# Altium schematic sheet boltanka.SchDoc
size A
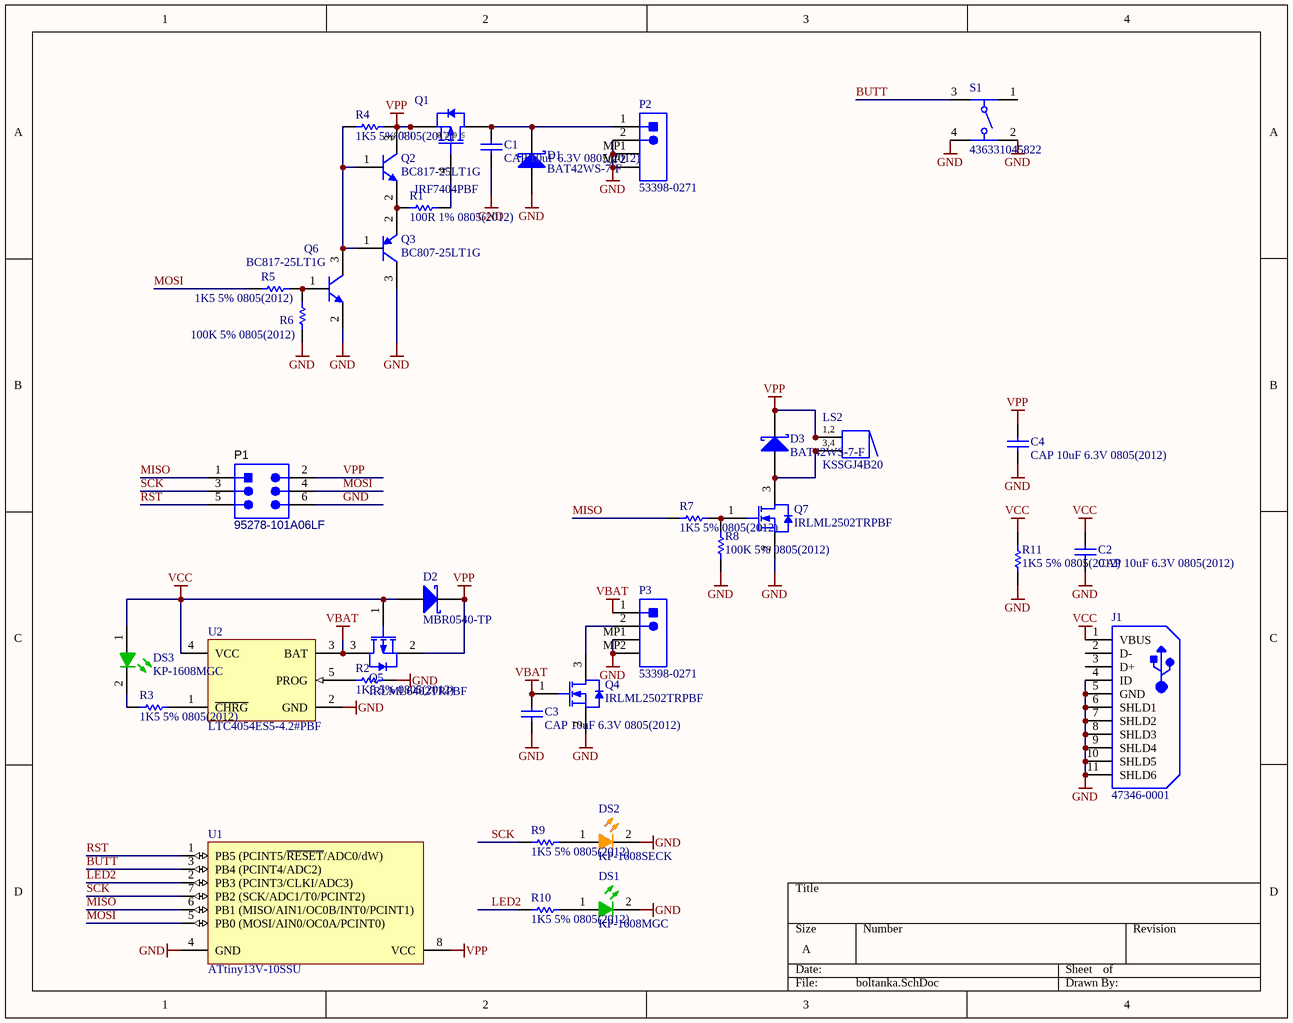
[diagram p0: boltanka.SchDoc]

## Parts
C1  CAP 10uF 6.3V 0805(2012)  [CAPC0805(2012)100_L]
C2  CAP 10uF 6.3V 0805(2012)  [CAPC0805(2012)100_L]
C3  CAP 10uF 6.3V 0805(2012)  [CAPC0805(2012)100_L]
C4  CAP 10uF 6.3V 0805(2012)  [CAPC0805(2012)100_L]
D1  BAT42WS-7-F  [DIOD-SOD323-2_V]
D2  MBR0540-TP  [MCC-SOD123_V]
D3  BAT42WS-7-F  [DIOD-SOD323-2_V]
DS1  KP-1608MGC  [KING-0603LED_GREEN_V]
DS2  KP-1608SECK  [KING-0603LED_ORANGE_V]
DS3  KP-1608MGC  [KING-0603LED_GREEN_V]
J1  47346-0001  [MOLX-47346-0001-5_V]
LS2  KSSGJ4B20  [KINGS-KSSGJ4B20_V]
P1  95278-101A06LF  [AMPM-95278-101A06LF_V]
P2  53398-0271  [MOLX-53398-0271_V]
P3  53398-0271  [MOLX-53398-0271_V]
Q1  IRF7404PBF  [INF-SOIC-8_V]
Q2  BC817-25LT1G  [ONSC-SOT-23-3-318-08_V]
Q3  BC807-25LT1G  [ONSC-SOT-23-3-318-08_V]
Q4  IRLML2502TRPBF  [INTR-SOT-23-3_V]
Q5  IRLML6402TRPBF  [INTR-SOT-23-3_V]
Q6  BC817-25LT1G  [ONSC-SOT-23-3-318-08_V]
Q7  IRLML2502TRPBF  [INTR-SOT-23-3_V]
R1  100R 1% 0805(2012)  [RESC0805(2012)_L]
R2  1K5 5% 0805(2012)  [RESC0805(2012)_L]
R3  1K5 5% 0805(2012)  [RESC0805(2012)_L]
R4  1K5 5% 0805(2012)  [RESC0805(2012)_L]
R5  1K5 5% 0805(2012)  [RESC0805(2012)_L]
R6  100K 5% 0805(2012)  [RESC0805(2012)_L]
R7  1K5 5% 0805(2012)  [RESC0805(2012)_L]
R8  100K 5% 0805(2012)  [RESC0805(2012)_L]
R9  1K5 5% 0805(2012)  [RESC0805(2012)_L]
R10  1K5 5% 0805(2012)  [RESC0805(2012)_L]
R11  1K5 5% 0805(2012)  [RESC0805(2012)_L]
S1  436331045822  [4363x10458xx]
U1  ATtiny13V-10SSU  [S8S1_M]
U2  LTC4054ES5-4.2#PBF  [LT-S5-5-TSOT-23_M]

## Nets
GND: C1.1 C2.1 C3.1 C4.1 D1.1(A) DS1.2(K) DS2.2(K) J1.4(ID) J1.5(GND) J1.6(SHLD1) J1.7(SHLD2) J1.8(SHLD3) J1.9(SHLD4) J1.10(SHLD5) J1.11(SHLD6) P1.6 P2.2 P2.MP1 P2.MP2 P3.MP1 P3.MP2 Q3.3(C) Q4.2(S) Q6.2(E) Q7.2(S) R2.2 R6.1 R8.1 R11.1 S1.2 S1.4 U1.4(GND) U2.2(GND)
VBAT: C3.2 P3.1 Q4.1(G) Q5.3(DRAIN) U2.3(BAT)
VCC: C2.2 D2.1(A) DS3.1(A) J1.1(VBUS) Q5.1(GATE) R11.2 U2.4(VCC)
VPP: C4.2 D2.2(K) D3.2(K) LS2.1 LS2.2 P1.2 Q1.1(S) Q1.2(S) Q1.3(S) Q2.3(C) Q5.2(SOURCE) R4.2 U1.8(VCC)
BUTT: S1.3 U1.3(PB4_(PCINT4/ADC2))
LED2: R10.1 U1.2(PB3_(PCINT3/CLKI/ADC3))
MISO: P1.1 R7.1 U1.6(PB1_(MISO/AIN1/OC0B/INT0/PCINT1))
MOSI: P1.4 R5.1 U1.5(PB0_(MOSI/AIN0/OC0A/PCINT0))
RST: P1.5 U1.1(PB5_(PCINT5/~{RESET}/ADC0/dW))
SCK: P1.3 R9.1 U1.7(PB2_(SCK/ADC1/T0/PCINT2))
NetC1_2: C1.2 D1.2(K) P2.1 Q1.5(D) Q1.6(D) Q1.7(D) Q1.8(D)
NetD3_1: D3.1(A) LS2.3 LS2.4 Q7.3(D)
NetDS1_1: DS1.1(A) R10.2
NetDS2_1: DS2.1(A) R9.2
NetDS3_2: DS3.2(K) R3.1
NetP3_2: P3.2 Q4.3(D)
NetQ1_4: Q1.4(G) R1.2
NetQ2_1: Q2.1(B) Q3.1(B) Q6.3(C) R4.1
NetQ2_2: Q2.2(E) Q3.2(E) R1.1
NetQ6_1: Q6.1(B) R5.2 R6.2
NetQ7_1: Q7.1(G) R7.2 R8.2
NetR2_1: R2.1 U2.5(PROG)
NetR3_2: R3.2 U2.1(~{CHRG})

Not connected (* = marked no-connect by the designer): J1 2(D-) 3(D+); S1 1

## Notes on the sheet
- (in symbol CMP-2000-06465-1) 1, 2, 3; 5, 6, 7, 8
- (in symbol CMP-2000-06519-1) 1,2; 3,4

## Library data of the parts
C1-C4 = CMP-1036-04917-1: CAP 10uF 6.3V ±10% 0805 (2012 Metric) Thickness 1mm SMD; Tolerance: Â±10%; Case-EIA: 0805; Case-Metric: 2012; Max Thickness: 1 mm; Value: 10uF; Technology: SMT; Rated Voltage: 6.3 V
D1 D3 = CMP-2000-05925-1: Schottky Barrier Diode, 30 V, -55 to 125 degC, 2-Pin SOD323, RoHS, Tape and Reel; Manufacturer: DiodesIncorporated; Ir - Reverse Current: 0.5uAat25V; Type: SurfaceMountSchottkyBarrierDiode; If - Forward Current: 0.1A; Pd - Power Dissipation: 200mW; Vf - Forward Voltage: 1Vat0.2A; Unit Weight: 0.000173oz; Ifsm - Forward Surge Current: 4A; trr - Reverse Recovery time: 5ns; Configuration: Single; Vrrm - Repetitive Reverse Voltage: 30V; RoHS: True; Height: 1mm; Length: 1.8mm; Packaging: Reel; Package Reference: SOD323-2; Manufacturer URL: http://www.diodes.com/; Mounting Style: SMD/SMT; Datasheet URL: http://www.diodes.com/_files/datasheets/ds30100.pdf; Package URL: http://www.vishay.com/docs/71192/71192.pdf; Maximum Operating Temperature: +125C; Brand: DiodesIncorporated; Series: BAT42; Technology: Si; Package / Case: SOD-323; Width: 1.4mm; Package Description: 2-Pin Surface Mount Device, Body 1.7 x 1.3 mm; Termination Style: SMD/SMT; Minimum Operating Temperature: -55C; Datasheet Version: Rev. 14-2, 06/2012; Operating Temperature Range: -55Cto+125C; Product: SchottkyDiodes; Mounting Technology: SurfaceMount; Product Category: SchottkyDiodes&Rectifiers; Factory Pack Quantity: 3000
D2 = CMP-2000-06672-1: Schottky Rectifier, 0.5 A, 40 V, -55 to 150 degC, 2-Pin SOD123, Pb-Free, Tape and Reel; Manufacturer: Micro Commercial Components; Reverse Current-Max: 0.2mA; Average Rectified Current-Max: 0.5A; Forward Voltage: 0.55V; Peak Current-Max: 5.5A; Reverse Voltage-Max [Vrrm]: 40V; Package URL: http://www.mccsemi.com/up_pdf/1N4448W(SOD-123).pdf; Package Reference: SOD123; Package Description: 2-Pin Small Outline Diode, Body 2.7 x 1.6 mm, Height 1.35 mm; Datasheet Version: Rev. C, 09/2014; Datasheet URL: http://www.mccsemi.com/up_pdf/MBR0520~MBR0580(SOD123).pdf; Mounting Technology: SurfaceMount; Manufacturer URL: http://www.mccsemi.com/
DS1 DS3 = CMP-0404-00001-1: LED, SMT, 0603(1608), 1.1mm thickness, Green; Manufacturer: Kingbright; Reverse Voltage: 5 V; Power Dissipation: 75 mW; Forward Current: 30 mA; Packing Type: 2000 pcs / reel; Mounting Technology: Surface Mount; Storage Temperature: -40 to +85 degC; ComponentLink1URL: http://www.kingbright.com/; PackageDescription: 2-Pin SMT LED, 1.6 x 0.8 mm Pitch; PartNumber: KP-1608MGC; PackageReference: 0603LED_GREEN; ComponentLink1Description: Manufacturer URL
DS2 = CMP-0404-00002-1: LED, SMT, 0603(1608), 1.1mm thickness, Orange; Manufacturer: Kingbright; Power Dissipation: 75 mW; Packing Type: 2000 pcs / reel; Reverse Voltage: 5 V; Forward Current: 30 mA; Storage Temperature: -40 to +85 degC; ComponentLink2Description: Datasheet; ComponentLink1URL: http://www.kingbright.com/; Mounting Technology: Surface Mount; ComponentLink2URL: http://www.kingbright.com/manager/upload/pdf/(1366274642)KP-1608SECK(Ver.14A).pdf; PackageDescription: 2-Pin SMT LED, 1.6 x 0.8 mm Pitch; PartNumber: KP-1608SECK; ComponentLink1Description: Manufacturer URL; PackageReference: 0603LED_ORANGE
J1 = CMP-2000-05246-1: Micro-USB B Receptacle with Flange, -30 to 85 degC, 5-Pin SMD, RoHS, Tape and Reel; Manufacturer: Molex; Number of Contacts: 5; Body Orientation: RightAngle; Maximum Voltage Rating: 30VAC; Pitch: 0.65mm; Maximum Current Rating: 1.8/ContactA; Number of Ports: 1; Gender: RCP; Operating Temperature: -30to85C; Part No: 47346-0001; Color: Black; Termination Method: Solder; Contact Plating: GoldOverPalladiumNickelOverNickel; Dimension: 7.8x5.43x2.94mm; Number of Terminals: 5; Datasheet Version: Dec-13; Datasheet URL: https://datasheet.ciiva.com/30075/304740473460001-io-nectors-30075527.pdf; Contact Material: CopperAlloy; RoHS: Yes; Housing Material: LiquidCrystalPolymer; Manufacturer URL: http://www.molex.com/; Packaging: EmbossedTapeandReel; Mounting: SurfaceMount; Type: MicroUSBTypeB
LS2 = CMP-2000-06519-1: Electromagnetic Buzzer, 3 to 5 V, 80 mA, 2.73 kHz, -30 to 70 degC, 4-Pin SMD, RoHS, Tape and Reel; Manufacturer: KingstateElectronicsCorp.; Product Height: 3.2mm; Product Length: 8.5mm; Minimum Sound Pressure: 90dBA; Maximum Resonant Frequency: 2730(Typ)Hz; Maximum Supply Current: 80mA; Typical Operating Supply Voltage: 3.6Vo-p; Package Reference: KSSGJ4B20; Package Description: 4-Pin Surface Mount Device, Body 8.5 x 8.5 mm; Datasheet Version: Rev. 1.2, 04/2005; Technology: Magnetic; Mounting Technology: SurfaceMount; Manufacturer URL: http://www.kingstate.com.tw/index.php/en/; Category: AudioIndicatorsandAlerts; Type: Transducer; Datasheet URL: http://datasheet.octopart.com/KSSGJ4B20-Kingstate-datasheet-5458884.pdf; Mounting: SurfaceMount; Termination Method: SolderPad; Operating Temperature: -30to70°C; Product Depth: 8.5mm
P1 = CMP-1743-00002-1: Male Header, Pitch 2.54 mm, 2 x 3 Position, Height 14.4 mm, RoHS, Tape and Reel; Power Rating: 100 mW; Tolerance: 1%; Resistance: 49.9 Ohm; Case\Package: 0603; Voltage Rating: 50 V; DatasheetVersion: Rev. AC, 03/2016; PackageDescription: Male Header, Pitch 2.54 mm, 2 x 3 Position, Height 14.4 mm; REACH SVHC: No SVHC; Height: 0.45 mm; Mount: Surface Mount; Case Code (Imperial): 0603; Max Operating Temperature: 155 degC; Case Code (Metric): 1608; Packaging: Tape and Reel; RoHSCompliant: true; ComponentLink1Description: Datasheet; Min Operating Temperature: -55 degC; Length: 1.6 mm; Width: 0.8 mm; ComponentLink1URL: http://portal.fciconnect.com/Comergent//fci/drawing/95278.pdf; PackageReference: 95278-101A06LF
P2 P3 = CMP-2000-07600-1: Male Header, Pitch 1.25 mm, 1 x 2 Position, Height 4.7 mm, -40 to 85 degC, RoHS, Tape and Reel; Manufacturer: Molex; Voltage Rating: 125V; Glow Wire Compliant: Non-compliant; Pitch: 1.25mm; Number of Positions: 2; Contact Resistance: 20mOhm; Insulation Resistance: 100MOhm; Current Rating: 1A; Mounting Technology: SurfaceMount; Colour: Natural; Mount: SurfaceMount; Termination: Solder; Packaging: TapeandReel; REACH SVHC: Unknown; Voltage Rating (AC): 125V; Housing Colour: Natural; Manufacturer URL: http://www.molex.com/; Max Operating Temperature: 85degC; Gender: Male; Lead Free: LeadFree; RoHSCompliant: True; Contact Plating: Tin; Package Reference: 53398-0271; Contact Material: Tin; Orientation: Vertical; Datasheet URL: http://www.molex.com/pdm_docs/sd/533980271_sd.pdf; Working Voltage: 125V; Flammability Rating: UL94V-0; Number of Contacts: 2; Package Description: Male Header, Pitch 1.25 mm, 1 x 2 Position, Height 4.7 mm; Datasheet Version: Rev. J, 09/2015; Number of Circuits: 2; Number of Rows: 1; Radiation Hardening: No; Voltage Rating (DC): 125V; Min Operating Temperature: -40degC; Housing Material: Nylon; Package Quantity: 1000
Q1 = CMP-2000-06465-1: HEXFET(R) Power MOSFET, 6.7 A, 20 V, 8-Pin SOIC, RoHS, Tape and Reel; Manufacturer: InfineonTechnologies; Vgs(th) (Max) @ Id: 700mV@250µA; Current - Continuous Drain (Id) @ 25°C: 6.7A(Ta); Gate Charge (Qg) @ Vgs: 50nC@4.5V; FET Feature: Standard; Input Capacitance (Ciss) @ Vds: 1500pF@15V; FET Type: MOSFETP-Channel,MetalOxide; Rds On (Max) @ Id, Vgs: 40mOhm@3.2A,4.5V; Power - Max: 2.5W; Drain to Source Voltage (Vdss): 20V; Package Reference: SOIC-8; Mounting Type: SurfaceMount; Datasheet Version: 09/2004; Family: Transistors-FETs,MOSFETs-Single; Package / Case: 8-SOIC(0.154",3.90mmWidth); Category: DiscreteSemiconductorProducts; Mounting Technology: SurfaceMount; Packaging: Tube; Package Description: 8-Pin Small Outline Integrated Circuit, Body 4.9 x 3.9 mm, Pitch 1.27 mm; Part Status: NotForNewDesigns; Operating Temperature: -55°C~150°C(TJ); Supplier Device Package: 8-SO; Series: HEXFET®; Manufacturer URL: http://www.infineon.com/; Datasheet URL: http://www.infineon.com/dgdl/irf7404pbf.pdf?fileId=5546d462533600a4015355fa31be1ba0
Q2 Q6 = CMP-1048-00737-1: General Purpose Transistor, NPN Silicon, 3-Pin SOT-23, Pb-Free, Tape and Reel; Manufacturer: On Semiconductor; IC Continuous (A): 0.5; fT Min (MHz): 100; PackageDescription: 3-Pin Small Outline Transistor, Body 2.92 x 1.3 mm, Pitch 0.95 mm; ComponentLink3Description: Package Specification; ComponentLink2Description: Datasheet; RoHS: TRUE; PackageVersion: Rev. AP, 11/2009; ComponentLink1URL: http://www.onsemi.com/; PackageReference: SOT-23-3-318-08; ComponentLink3URL: http://www.onsemi.cn/pub_link/Collateral/318-08.PDF; ComponentLink2URL: http://www.onsemi.com/pub_link/Collateral/BC817-16LT1-D.PDF; Mounting Technology: Surface Mount; Packing: Tape and Reel; DatasheetVersion: Rev. 12; Polarity: NPN; PartNumber: BC817-25LT1G; ComponentLink1Description: Manufacturer URL
Q3 = CMP-1048-00691-1: General Purpose Transistor, PNP Silicon, 3-Pin SOT-23, Pb-Free, Tape and Reel; Manufacturer: On Semiconductor; IC Continuous (A): -0.5; fT Min (MHz): 100; PackageDescription: 3-Pin Small Outline Transistor, Body 2.92 x 1.3 mm, Pitch 0.95 mm; Polarity: PNP; ComponentLink2URL: http://www.onsemi.com/pub_link/Collateral/BC807-16LT1-D.PDF; PackageReference: SOT-23-3-318-08; ComponentLink2Description: Datasheet; ComponentLink1Description: Manufacturer URL; PartNumber: BC807-25LT1G; ComponentLink3URL: http://www.onsemi.cn/pub_link/Collateral/318-08.PDF; Packing: Tape and Reel; DatasheetVersion: Rev. 10; RoHS: TRUE; ComponentLink3Description: Package Specification; PackageVersion: Rev. AP, 11/2009; ComponentLink1URL: http://www.onsemi.com/; Mounting Technology: Surface Mount
Q4 Q7 = CMP-2000-04985-1: N-Channel HEXFET(R) Power MOSFET, 20 V VDS, +/- 12 V VGS, 4.2 A, 3-Pin SOT23, RoHS, Tape and Reel; Manufacturer: International Rectifier; Drain-to-Source Voltage [Vdss]: 20V; Drain-Source On Resistance-Max: 0.045O; Qg Gate Charge: 8nC; Rated Power Dissipation: 1.25W; Package Reference: SOT-23-3; Manufacturer URL: http://internationalrectifier.com/; Package Description: 3-Pin Small Outline Transistor, Body 2.92 x 1.3 mm, Pitch 0.95 mm; Datasheet Version: Apr-14; Channel Type: N-Channel; Datasheet URL: https://datasheet.ciiva.com/6383/irlml2502pbf-6383216.pdf
Q5 = CMP-2000-04987-1: HEXFET(R) Power P-Channel MOSFET, -20 V, -3.7 A, -55 to 150 degC, 3-Pin SOT-23, RoHS, Tape and Reel; Manufacturer: International Rectifier; Drain-to-Source Voltage [Vdss]: 20V; Rated Power Dissipation: 1.3W; Qg Gate Charge: 8nC; Drain-Source On Resistance-Max: 0.065O; Channel Type: P-Channel; Package Reference: SOT-23-3; Manufacturer URL: http://internationalrectifier.com/; Datasheet URL: http://datasheet.octopart.com/IRLML6402TRPBF-International-Rectifier-datasheet-93882.pdf; Datasheet Version: Feb-05; Package Description: 3-Pin Small Outline Transistor, Body 2.92 x 1.3 mm, Pitch 0.95 mm
R1 = CMP-1013-00397-1: 100R 0.125W 1% 0805 (2012 Metric)  SMD; Value: 100.00 Ohm; Case-Metric: 2012; Case-EIA: 0805; Technology: SMT; Power: 0.125 W; Tolerance: 1 %
R2-R5 R7 R9-R11 = CMP-1013-00078-1: 1K5 0.125W 5% 0805 (2012 Metric)  SMD; Case-EIA: 0805; Value: 1500.00 Ohm; Case-Metric: 2012; Power: 0.125 W; Technology: SMT; Tolerance: 5 %
R6 R8 = CMP-1013-00122-1: 100K 0.125W 5% 0805 (2012 Metric)  SMD; Case-Metric: 2012; Value: 100000.00 Ohm; Case-EIA: 0805; Tolerance: 5 %; Technology: SMT; Power: 0.125 W
S1 = 436331045822: WS-TASU 3.5x4.7 mm SMD side push, boss design; Operation Force: 220g; ComponentLink1Description: Manufacturer; ComponentLink1URL: http://www.we-online.de; ComponentLink2Description: Datasheet; ComponentLink2URL: http://katalog.we-online.de/em/datasheet/4363x10458xx.pdf; Part Number: 436331045822; Published Date: June 2017; Publisher: Wurth Elektronik; Life Cycle: 100000 cycles; Size: 4.7x3.5mm
U1 = CMP-0093-00147-2: 8-bit AVR Microcontroller, 1.8-5.5V, 1KB Flash, 64 Bytes EEPROM, 64 Bytes SRAM, 8-pin SOIC, Industrial Grade (-40°C to 85°C), Pb-Free; ComponentLink3URL: http://www.atmel.com/dyn/resources/prod_documents/2535S.pdf; Code_JEDEC: MS-012; RevisionNote: DatasheetVersion updated. Removed ComponentAvailability note. URLs added.; PackageVersion: revA, Oct-2001; ComponentLink1Description: Manufacturer URL; ComponentLink1URL: http://www.atmel.com/; ComponentLink2URL: http://www.atmel.com/dyn/resources/prod_documents/doc2535.pdf; PackageReference: S8S1; ComponentLink2Description: ATtiny13  Datasheet; Code_IPC: SOIC127P600-8; ComponentLink3Description: ATtiny13 Summary; DatasheetVersion: revJ, Aug-2010; PackageDescription: 8-Lead (0.150" Wide Body), Plastic Gull Wing Small Outline (JEDEC SOIC)
U2 = CMP-0471-00451-1: Standalone Linear Li-Ion Battery Charger with Thermal Regulation, 4.25 to 6.5 V Vin, 5-pin SOT23 (S5-5), -40 to 85 degC, Pb-Free; Manufacturer: Linear Technology; Vin Max(V): 6.5; Float Voltage: 4.2 V; Battery Chemistry: Li-Ion, Li-Polymer; Charge Termination: C/10; Max Charge Current(A): 0.8; Vin Min(V): 4.25; Number of Cells: 1; ComponentLink2Description: Datasheet; ComponentLink3Description: Package Specification; ComponentLink3URL: http://cds.linear.com/docs/en/packaging/SOT_5_05-08-1635.pdf; ComponentLink1Description: Manufacturer URL; Mounting Technology: Surface Mount; RoHS: TRUE; Code_JEDEC: MO-193; Type of Charger: Linear; PartNumber: LTC4054ES5-4.2#PBF; PackageVersion: Jun-10; ComponentLink1URL: http://www.linear.com/; PackageReference: S5-5; ComponentLink2URL: http://cds.linear.com/docs/en/datasheet/405442xf.pdf; PackageDescription: 5-Pin Plastic TSOT-23, Body 1.63 x 2.90 mm, Pitch 0.95 mm